# EAGLE design untitled (EAGLE 6.5.0)
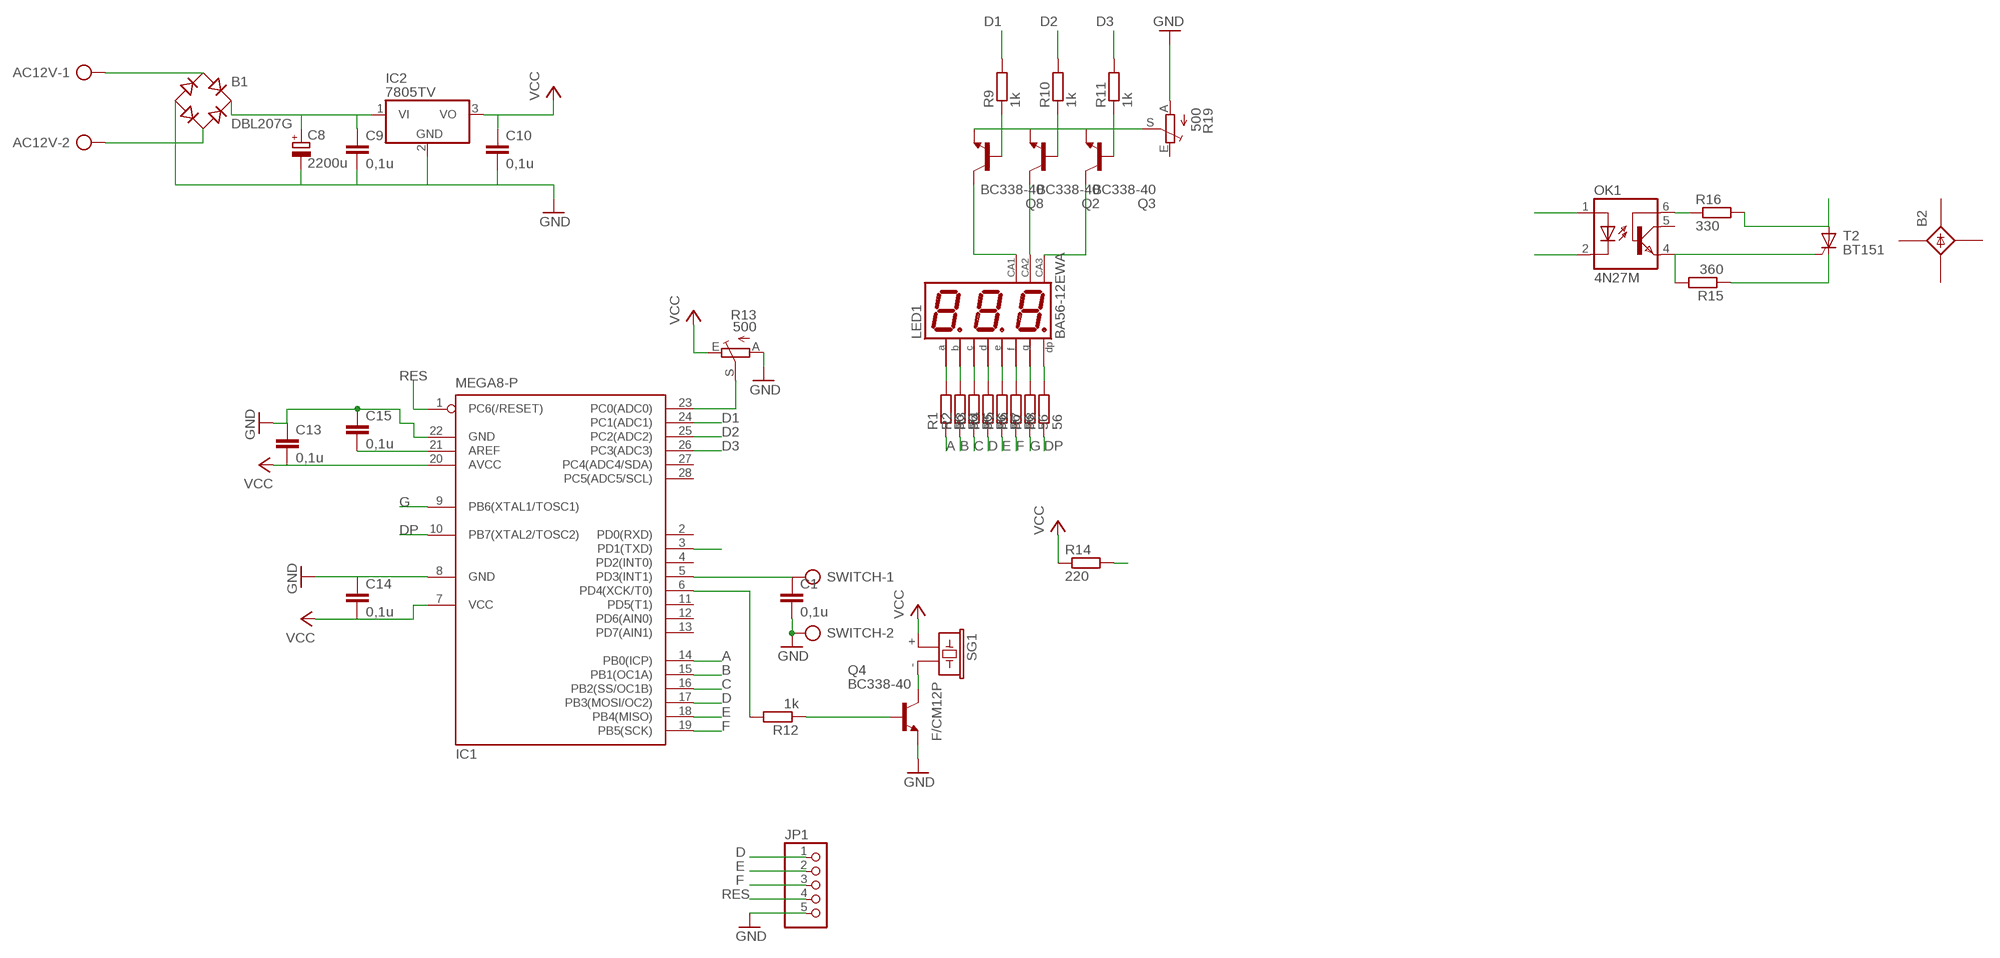
[diagram p0: schematic, sheet 1]

## Parts
AC12V  AK500/2  [AK500/2]
B1  DBL207G  [DB]
B2  B25A-  [B25A-]
C1  0,1u  C-EUC1206K  [C1206K]
C8  2200u  CPOL-EUE7.5-16  [E7,5-16]
C9  0,1u  C-EUC1206K  [C1206K]
C10  0,1u  C-EUC1206K  [C1206K]
C13  0,1u  C-EUC1206K  [C1206K]
C14  0,1u  C-EUC1206K  [C1206K]
C15  0,1u  C-EUC1206K  [C1206K]
IC1  MEGA8-P  [DIL28-3]
IC2  7805TV  [TO220V]
JP1  PINHD-1X5  [1X05]
LED1  BA56-12EWA  [BX56-12]
OK1  4N27M  [DIL06]
Q2  BC338-40  [TO92-EBC]
Q3  BC338-40  [TO92-EBC]
Q4  BC338-40  [TO92-EBC]
Q8  BC338-40  [TO92-EBC]
R1  56  R-EU_0204/7  [0204/7]
R2  56  R-EU_0204/7  [0204/7]
R3  56  R-EU_0204/7  [0204/7]
R4  56  R-EU_0204/7  [0204/7]
R5  56  R-EU_0204/7  [0204/7]
R6  56  R-EU_0204/7  [0204/7]
R7  56  R-EU_0204/7  [0204/7]
R8  56  R-EU_0204/7  [0204/7]
R9  1k  R-EU_0204/7  [0204/7]
R10  1k  R-EU_0204/7  [0204/7]
R11  1k  R-EU_0204/7  [0204/7]
R12  1k  R-EU_0204/7  [0204/7]
R13  500  TRIM_EU-CA6V  [CA6V]
R14  220  R-EU_0204/7  [0204/7]
R15  360  R-EU_0204/7  [0204/7]
R16  330  R-EU_0204/7  [0204/7]
R19  500  TRIM_EU-CA6V  [CA6V]
SG1  F/CM12P  [F/CM12P]
SWITCH  AK500/2  [AK500/2]
T2  BT151  [TO220CL]

## Nets
A: IC1.14(PB0(ICP)) R1.1
B: IC1.15(PB1(OC1A)) R2.1
C: IC1.16(PB2(SS/OC1B)) R3.1
C1: OK1.1(A) R14.2
C2: IC1.3(PD1(TXD)) OK1.2(C)
D: IC1.17(PB3(MOSI/OC2)) JP1.1 R4.1
D1: IC1.24(PC1(ADC1)) R9.2
D2: IC1.25(PC2(ADC2)) R10.2
D3: IC1.26(PC3(ADC3)) R11.2
DP: IC1.10(PB7(XTAL2/TOSC2)) R8.1
E: IC1.18(PB4(MISO)) JP1.2 R5.1
F: IC1.19(PB5(SCK)) JP1.3 R6.1
G: IC1.9(PB6(XTAL1/TOSC1)) R7.1
GND: B1.- C1.2 C8.- C9.2 C10.2 C13.1 C14.1 C15.1 IC1.8(GND) IC1.22(GND) IC2.2(GND) JP1.5 Q4.E R13.A R19.A SWITCH.2
N$1: LED1.11(A) R1.2
N$2: LED1.7(B) R2.2
N$3: LED1.4(C) R3.2
N$4: LED1.2(D) R4.2
N$5: LED1.1(E) R5.2
N$6: LED1.10(F) R6.2
N$7: LED1.5(G) R7.2
N$8: LED1.3(DP) R8.2
N$10: AC12V.1 B1.AC1
N$11: AC12V.2 B1.AC2
N$13: B1.+ C8.+ C9.1 IC2.1(VI)
N$14: C15.2 IC1.21(AREF)
N$15: LED1.12(CA) Q8.C
N$16: LED1.9(CA) Q2.C
N$17: LED1.8(CA) Q3.C
N$18: Q8.B R9.1
N$19: Q2.B R10.1
N$20: Q3.B R11.1
N$21: Q2.E Q3.E Q8.E R19.S
N$22: IC1.6(PD4(XCK/T0)) R12.2
N$23: Q4.B R12.1
N$24: Q4.C SG1.-
N$25: C1.1 IC1.5(PD3(INT1)) SWITCH.1
N$26: IC1.23(PC0(ADC0)) R13.S
N$31: OK1.6(BAS) R16.1
N$32: OK1.4(EMI) R15.2 T2.G
N$33: R15.1 T2.C
N$34: R16.2 T2.A
RES: IC1.1(PC6(/RESET)) JP1.4
VCC: C10.1 C13.2 C14.2 IC1.7(VCC) IC1.20(AVCC) IC2.3(VO) R13.E R14.1 SG1.+
Unconnected: B2.+ B2.+1(+) B2.- B2.-1(-) B2.AC1 B2.AC1-(AC1) B2.AC2 B2.AC2-(AC2) IC1.2(PD0(RXD)) IC1.4(PD2(INT0)) IC1.11(PD5(T1)) IC1.12(PD6(AIN0)) IC1.13(PD7(AIN1)) IC1.27(PC4(ADC4/SDA)) IC1.28(PC5(ADC5/SCL)) OK1.5(COL) R19.E

## Library data of the parts
AC12V SWITCH = con-ptr500:AK500/2: CONNECTOR; OC_FARNELL: unknown; OC_NEWARK: unknown
B1 = rectifier:DB?*G: Single Phase 1.0 AMP Glass Passivated Bridge Rectifier Taiwan Semiconductor Co.,Ltd. - TSC Source: http://www.taiwansemi.com/TSCbig5/ezcatfiles/cust/img/img/db101g.pdf http://www.ts.com.tw/db/pictures/modules/PDT/PDT060207001/DBLS201G.pdf
B2 = rectifier:B25A-: RECTIFIER 25-A bridge
C1 C9 C10 C13-C15 = rcl:C-EU: CAPACITOR, European symbol
C8 = rcl:CPOL-EU: POLARIZED CAPACITOR, European symbol
IC1 = atmel:MEGA8-P: MICROCONTROLLER 8 Kbytes FLASH, 1 kbytes SRAM, 512 bytes EEPROM, USART, 4-channel 10 bit ADC, 2-channel 8 bit ADC Pin compatible with Atmega48, ATMega88, ATMega168 Source: avr.lbr; OC_FARNELL: unknown; OC_NEWARK: unknown
IC2 = linear:78*: Positive VOLTAGE REGULATOR Source: http://cache.national.com/ds/LM/LM78L05.pdf http://www.fairchildsemi.com/ds/LM/LM7805.pdf
JP1 = pinhead:PINHD-1X5: PIN HEADER
LED1 = display-kingbright:B?56-12*WA: 14.22mm (0.56INCH) THREE DIGIT NUMERIC DISPLAY Source: http://www.kingbright.com .. BA56-11EWA(Ver1189474895.pdf; OC_FARNELL: unknown; OC_NEWARK: unknown
OK1 = optocoupler:4N*?M: General Purpose 6-Pin Phototransistor Optocouplers Source: http://www.fairchildsemi.com/ds/4N/4N35-M.pdf; MF: FAIRCHILD SEMICONDUCTOR; MPN: 4N27M; OC_FARNELL: unknown; OC_NEWARK: 72K9939
Q2-Q4 Q8 = transistor-npn:BC338*: NPN Transistor
R1-R12 R14-R16 = rcl:R-EU_: RESISTOR, European symbol
R13 R19 = pot:TRIM_EU-: POTENTIOMETER
SG1 = buzzer:F/CM12P: BUZZER Source: Buerklin; OC_FARNELL: unknown; OC_NEWARK: unknown
T2 = triac:BT151: THYRISTOR

## Board
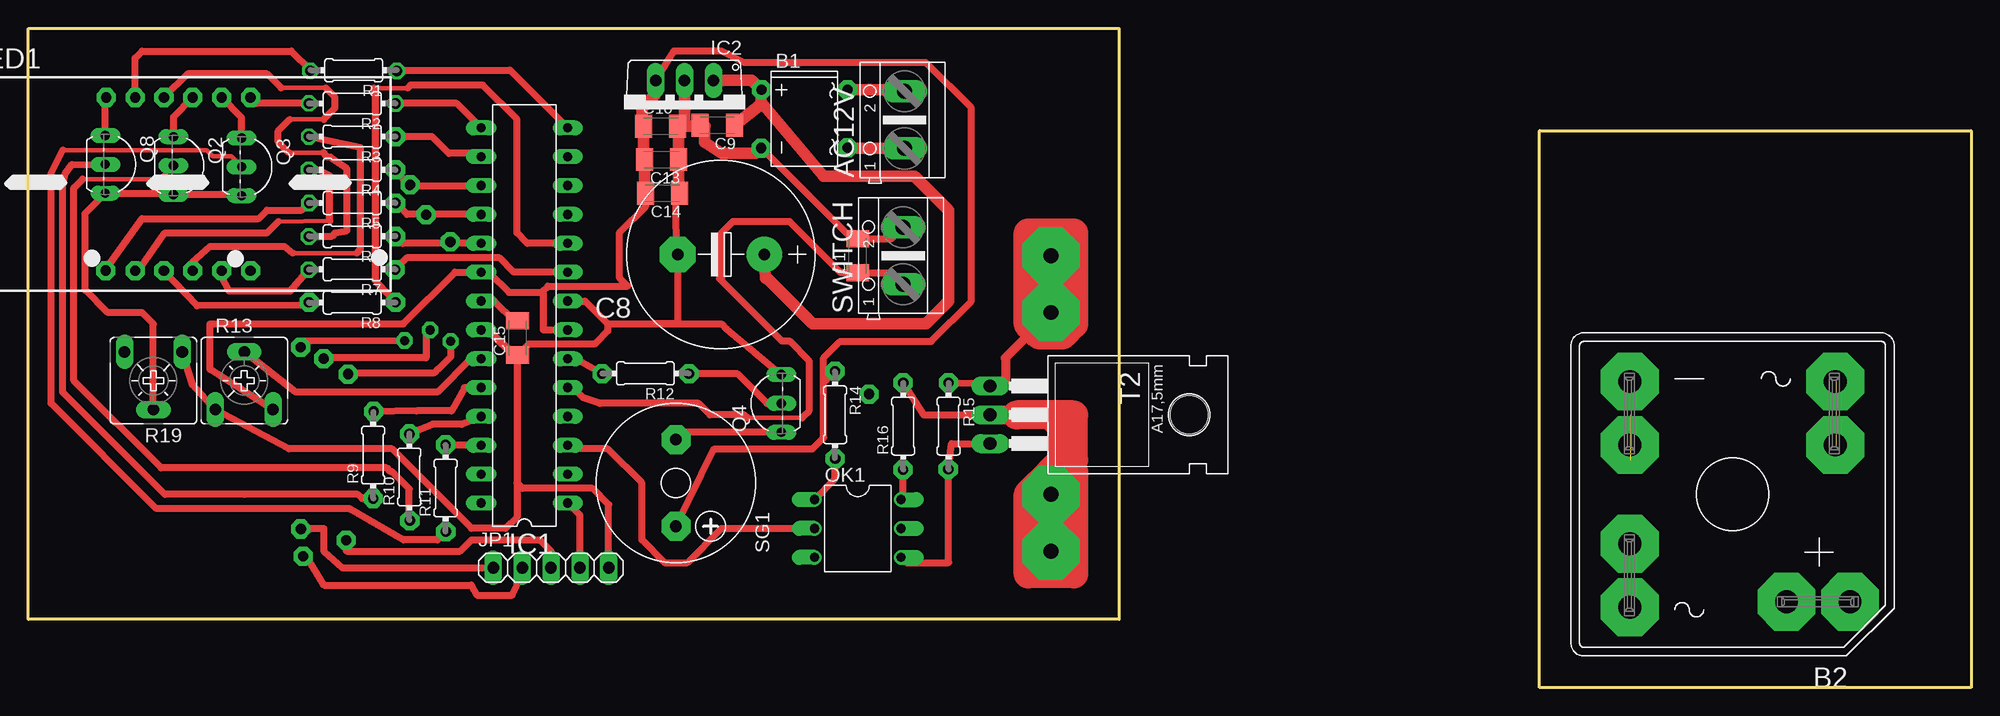
[diagram p1: board, top side]
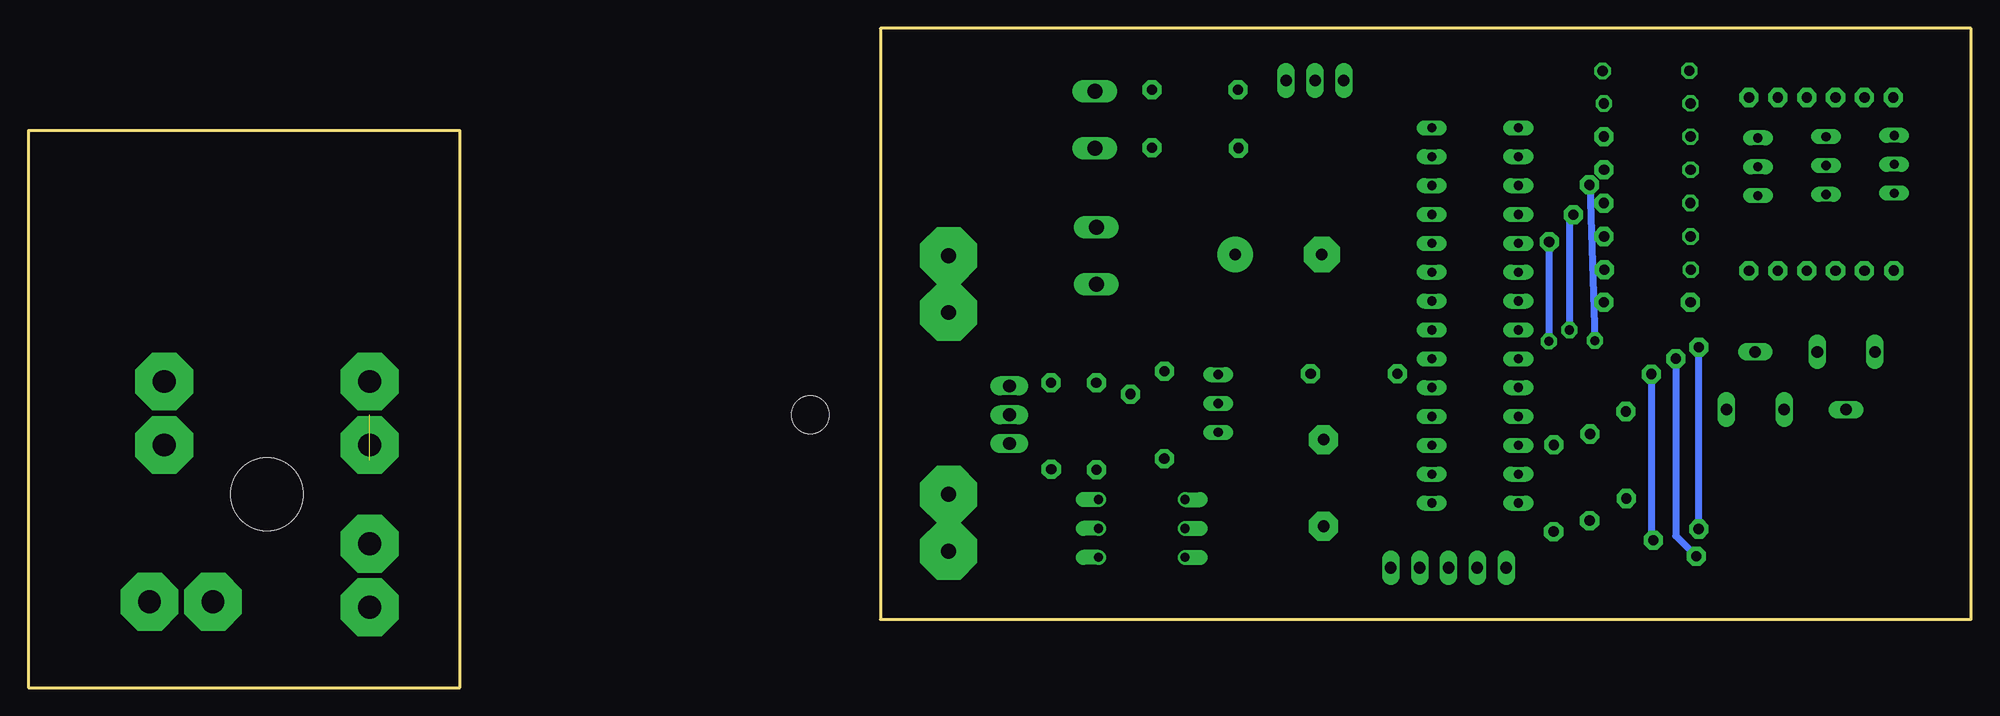
[diagram p2: board, bottom side, seen from below]

Size 171 x 58 mm. Coordinates in mm from the lower left corner, seen from the top.
Outline: 171,49 171,0 133,0 133,49 171,49
Outline: 96,58 96,6 0,6 0,58 96,58
Copper layers (1*16): Top 0.035mm / dielectric 1.5mm / Bottom 0.035mm
Design rules "default": minimum track width 10mil, minimum drill 24mil, track to track 8mil, track to pad 8mil, pad to pad 8mil, via to via 8mil, smd to smd 8mil, copper to edge 40mil, drill to drill 8mil, minimum pad ring 10mil, minimum via ring 8mil, stop-mask expansion 4mil, vias tented up to drill 0mil, thermal gap 10mil

### Footprints (pad centres in the part's own frame; a part is rotated, then mirrored left to right if it is on the bottom)
AK500/2 = drill 1.321 long: 1 -2.515,0; 2 2.515,0
DB = drill 0.813: + -2.54,-3.81 | drill 0.813 octagon: - 2.54,-3.81; AC1 2.54,3.81; AC2 -2.54,3.81
B25A- = drill 2.007 pad 5.08 octagon: + -10.338,9.449; +1 -4.75,9.449; - 9.042,-4.343; -1 9.042,-9.931; AC1 9.042,4.343; AC1- 9.042,9.931; AC2 -9.042,-4.343; AC2- -9.042,-9.931 | hole 6.401: 0,0
C1206K = smd 1.5 x 2: 1 -1.5,0; 2 1.5,0
E7,5-16 = drill 1.016 pad 3.15: + -3.81,0 | drill 1.016 pad 3.15 octagon: - 3.81,0
DIL28-3 = drill 0.813 long: 1 -16.51,-3.81; 2 -13.97,-3.81; 3 -11.43,-3.81; 4 -8.89,-3.81; 5 -6.35,-3.81; 6 -3.81,-3.81; 7 -1.27,-3.81; 8 1.27,-3.81; 9 3.81,-3.81; 10 6.35,-3.81; 11 8.89,-3.81; 12 11.43,-3.81; 13 13.97,-3.81; 14 16.51,-3.81; 15 16.51,3.81; 16 13.97,3.81; 17 11.43,3.81; 18 8.89,3.81; 19 6.35,3.81; 20 3.81,3.81; 21 1.27,3.81; 22 -1.27,3.81; 23 -3.81,3.81; 24 -6.35,3.81; 25 -8.89,3.81; 26 -11.43,3.81; 27 -13.97,3.81; 28 -16.51,3.81
TO220V = drill 1.016 long: 1 -2.54,-2.54; 2 0,-2.54; 3 2.54,-2.54
1X05 = drill 1.016 long: 1 -5.08,0; 2 -2.54,0; 3 0,0; 4 2.54,0; 5 5.08,0
BX56-12 = drill 0.8 pad 1.422: 1 -6.35,-7.62; 2 -3.81,-7.62; 3 -1.27,-7.62; 4 1.27,-7.62; 5 3.81,-7.62; 6 6.35,-7.62; 7 6.35,7.62; 8 3.81,7.62; 9 1.27,7.62; 10 -1.27,7.62; 11 -3.81,7.62; 12 -6.35,7.62
DIL06 = drill 0.813 offset: 1 -2.54,-3.81; 2 0,-3.81; 3 2.54,-3.81; 4 2.54,3.81; 5 0,3.81; 6 -2.54,3.81
TO92-EBC = drill 0.813 long: B 0,-1.27; C -2.54,-1.27; E 2.54,-1.27
0204/7 = drill 0.813 octagon: 1 -3.81,0; 2 3.81,0
CA6V = drill 1.016 long: A -2.54,-2.54; E 2.54,-2.54; S 0,2.54
F/CM12P = drill 1.016 pad 2.54 octagon: + 3.81,0; - -3.81,0
TO220CL = drill 1.118 long: A 0,-6.35; C -2.54,-6.35; G 2.54,-6.35 | hole 3.302: 0,11.176

### Placement (x,y rotation side)
AC12V  77.12,49.95 90 top
B1  68.31,50.05 270 top
B2  150,17 180 top
C1  73,38 90 top
C8  60.96,38.11 180 top
C9  60.64,49.47 180 top
C10  55.66,49.39 0 top
C13  55.74,46.46 180 top
C14  55.81,43.5 180 top
C15  43.07,30.76 90 top
IC1  43.66,32.74 90 top
IC2  57.75,50.88 180 top
JP1  46,10.54 0 top
LED1  13.2,44.3 0 top
OK1  73,14 270 top
Q2  14.04,45.93 270 top
Q3  20.04,45.82 270 top
Q4  65,25 90 top
Q8  8.04,46.04 270 top
R1  28.64,54.32 180 top
R2  28.5,51.4 180 top
R3  28.5,48.48 180 top
R4  28.5,45.56 180 top
R5  28.5,42.64 180 top
R6  28.5,39.72 180 top
R7  28.5,36.8 180 top
R8  28.5,33.88 180 top
R9  30.35,20.45 90 top
R10  33.53,18.53 90 top
R11  36.72,17.55 90 top
R12  54.31,27.64 180 top
R13  19,27 0 top
R14  71,24 270 top
R15  81,23 270 top
R16  77,23 90 top
R19  11,27 180 top
SG1  57,18 270 top
SWITCH  77,38 90 top
T2  91,24 270 top

### Tracks (layer width: path | path; a pad name or v marks a point on that pad's centre or on a via)
A
  Top 0.61: R1.1 42.4,54.32 IC1.14
B
  Top 0.61: IC1.15 37.7,51.4 R2.1
C
  Top 0.61: IC1.16 39.56,47 37,47 35.52,48.48 R3.1
C1
  Top 0.61: OK1.1 71,18.35 R14.2
C2
  Top 0.61: IC1.3 47.78,21 51,21 54,18 54,13 56,11 58,11 61,14 OK1.2
D  (via drill 0.8 pad 1.42)
  Top 0.61: v33.12,30.53 24,30.47 v24,30 | v24,14 26,14 26,12 27.6,10.54 JP1.1 | R4.1 32.31,45.41 v33.55,44.17 IC1.17
  Bottom 0.61: v33.55,44.17 v33.12,30.53 | v24,30 v24,14
D1
  Top 0.61: IC1.24 38.39,26.39 37.25,24.35 34.16,24.35 R9.2
D2
  Top 0.61: IC1.25 38.14,23.16 37.07,23.18 35.58,23.18 R10.2
D3
  Top 0.61: IC1.26 36.61,21.31 R11.2
DP
  Top 0.406: 33.39,52.75 30.4,52.75
  Top 0.61: IC1.10 43.91,39.09 43,40 43,50 40,53 33.64,53 33.39,52.75 | 30.4,52.75 30.5,52.18 30.5,35.86 R8.1
E  (via drill 0.8 pad 1.42)
  Top 0.61: IC1.18 v35,41.63 | v35,41.63 33.32,41.63 R5.1 | 35.5,41.66 35,41.66 v35,41.63 | v35.35,31.46 35,31.46 35,29 v26,29 | v24.19,11.54 24.46,11.54 26,9 39,9 39,8.93 39.46,8.13 42.59,8.13 43,9 43,10.54 JP1.2
  Bottom 0.61: v35,41.63 35.35,41.63 v35.35,31.46 | v26,29 26,13.35 v24.19,11.54
F  (via drill 0.8 pad 1.42)
  Top 0.61: IC1.19 37,39.09 | 37,39.09 32.94,39.09 R6.1 | v37.14,39.16 37,39.16 37,39.09 | v37.18,30.46 37.18,29.12 36.09,28.03 36.07,28.03 35.7,27.66 v28.15,27.66 v28.14,27.67 | v28,13 28,12 38,12 39,13 45,13 46,12 JP1.3
  Bottom 0.61: v37.14,39.16 37.18,39.16 v37.18,30.46 | 28.08,13.08 v28,13 28.14,13.14 v28.14,27.67
G
  Top 0.61: IC1.9 42.71,36.55 41.46,37.8 33.31,37.8 R7.1
GND
  Top 0.61: 49,34 48.99,34.01 IC1.8 49,34 | 51,32 51,31.38 49.95,30.33 49.95,30.31 49.85,30.21 44.02,30.21 C15.1 42.74,29.26 40.53,31.47 IC1.22 40.4,31.48 43,28.88 43,18 | 49,34 51,32 | 51,32 55,32 | 55,32 61,32 61.46,31.54 Q4.E | 43,18 43,15 42,14 39,14 32,21 22.92,21 R13.A 14.46,26.62 R19.A | SWITCH.2 75.98,39.5 C1.2 72.51,39.5 B1.- | C14.1 57,43.19 57,41 57.15,37.15 C8.- 57.13,31.99 55,32 | JP1.5 51.08,16.1 49.66,17.52 43.48,17.52 43,18
  Top 1.016: IC2.2 57.75,49.98 C10.2 | C10.2 59.58,49.39 C9.2 59.5,49.01 59.5,48 61,47 64,47 B1.- | C10.2 57.24,49.31 C13.1 57.24,43.57 C14.1
N$1
  Top 0.61: LED1.11 9.39,55.39 10,56 23.14,56 R1.2
N$2
  Top 0.61: R2.2 20.07,51.4 LED1.7
N$3
  Top 0.406: 23.28,38.23 28.92,38.23
  Top 0.61: LED1.4 14.47,37.47 16,38.82 22.51,38.82 23.28,38.23 | 28.92,38.23 29.23,38.63 29.23,47.51 R3.2
N$4
  Top 0.406: 22,41 26.53,41.06
  Top 0.61: LED1.2 9.68,36.68 12,40 21,40 22,41 | 26.53,41.06 26.51,45.04 25.44,45.56 R4.2
N$5
  Top 0.61: LED1.1 6.85,36.85 10,41.27 20.27,41.27 21,42 24.05,42 R5.2
N$6
  Top 0.406: 25.95,47.07 22.93,47.07 | 23,50 26,50 | 26.18,52.76 22.24,52.76
  Top 0.61: R6.2 26.72,39.72 27,40 27.02,40 28.05,40.21 28.05,45.63 26.57,46.67 26.3,46.67 26.1,46.87 26.1,46.92 25.95,47.07 | 22.93,47.07 22,48 22,49 23,50 | 26,50 27,51 27,51.94 26.18,52.76 | 22.24,52.76 21,54 14.01,54 LED1.10
N$7
  Top 0.61: LED1.5 17.01,36.06 17.63,34.91 23.05,34.91 R7.2
N$8
  Top 0.61: R8.2 24.44,33.63 14.84,33.59 LED1.3
N$10
  Top 1.016: AC12V.1 72.19,47.44 B1.AC1
N$11
  Top 1.016: B1.AC2 77,52.59 AC12V.2
N$13
  Top 1.016: IC2.1 63.67,53.42 B1.+ 64.5,51.31 C9.1 64.59,51.41 70,45 78,45 81,42 81,34 79,32 69,32 65,36 64.88,36 C8.+
N$14
  Top 0.61: IC1.21 41,34 42.74,32.26 C15.2
N$15
  Top 0.61: Q8.C 6.77,51.84 LED1.12
N$16
  Top 0.61: Q2.C 12.77,50.22 LED1.9
N$17
  Top 0.61: Q3.C 18.77,50.16 LED1.8
N$18
  Top 0.61: R9.1 29.36,16.64 29,17 25,17.01 19,17 12,17 3,26 3,44.27 3.22,45.21 3.82,46.02 Q8.B
N$19
  Top 0.406: 4.77,44.73 11.57,44.73 Q2.B
  Top 0.61: R10.1 33.53,17.47 32,19 31.86,19 31.54,19.32 11.68,19.32 4,27 4,44 4.04,44 4.77,44.73
N$20
  Top 0.406: 3.04,47.29 15.69,47.29 16.24,46.74 17.85,46.74 Q3.B
  Top 0.61: R11.1 36,13 33,13 28.26,15.74 11.26,15.74 2,25 2,45.25 3.04,47.29
N$21
  Top 0.61: R19.S 11,32 10,33 7,33 5,35 5,41.73 Q8.E 12.66,43.5 Q2.E 18.66,43.39 Q3.E
N$22
  Top 0.61: IC1.6 48.21,28.93 R12.2
N$23
  Top 0.61: R12.1 62.36,27.64 65,25 Q4.B
N$24
  Top 0.61: Q4.C 57.65,22.46 SG1.-
N$25
  Top 0.406: 68.11,23.72 63.28,23.72
  Top 0.61: IC1.5 47.94,26.39 48.81,25.52 50.29,25 59,25 60,24 63,24 63.28,23.72 | SWITCH.1 75.98,36.5 C1.1 71.5,36.5 67,41 62,41 61,40 61,36 60.81,36 66.31,30.5 66.98,30.5 68.71,28.77 68.71,24.32 68.11,23.72
N$26
  Top 0.61: IC1.23 38.93,28.93 36,26 23.54,26 R13.S
N$28  (via drill 0.9 pad 1.42, 0.9 pad 1.68)
  other vias: 77,26.82 81,26.82 71,27.82 74,25.82 71.02,20.14 76.99,19.17 80.97,19.2 64.49,47.47 72.1,47.49 72.11,52.59 64.53,52.59 58.14,27.62 50.49,27.62 27.98,12.95 23.98,13.95 24.18,11.55 30.34,16.63 33.58,14.69 36.75,13.72 36.73,21.35 33.54,22.31 30.38,24.29 28.14,27.58 26,28.94 23.97,29.94 6.81,36.69 9.39,36.68 11.93,36.68 14.47,36.68 17.01,36.68 17.01,36.68 17.01,36.68 19.55,36.68 19.55,51.92 17.01,51.92 14.47,51.92 11.93,51.92 9.39,51.92 6.85,51.92 24.8,54.28 24.7,51.4 32.44,54.25 32.32,51.39 32.32,48.48 24.7,48.48 24.69,45.56 32.31,45.56 32.33,42.63 24.71,42.63 24.69,39.69 32.31,39.69 32.29,36.77 24.67,36.77 24.7,33.91 32.32,33.91 35.01,41.59 37.14,39.23 33.61,44.24
N$31
  Top 0.61: OK1.6 77,16.73 R16.1
N$32
  Top 0.61: T2.G 81.27,21.46 R15.2 81,11 77.27,11 OK1.4
N$33  (via drill 1.3 pad 5)
  Top 0.61: R15.1 84.22,26.78 85.27,26.54 T2.C
  Top 0.813: v90,33 86,29 86,27 84.22,26.78
  Top 2.54: v90,38 v90,33 89,33 88,34 | 88,34 88,40 92,40 92,32 91,31 89,31 88,32 88,34
N$34  (via drill 1.3 pad 5)
  Top 0.61: R16.2 78.81,24 T2.A
  Top 1.676: T2.A 87,24
  Top 2.54: 90,24 91,23 91,20 | 90,19 v90,17 v90,12 | 91,20 92,19 92,10 88,10 88,17 90,19 | 90,19 91,20 | 91,20 92,20 92,24 90,24 | 90,24 87,24
N$38  (1 unrouted)
RES
  Top 0.61: JP1.4 48.54,15.16 IC1.1
VCC
  Top 0.61: IC1.20 40.53,36.55 | 40.53,36.55 42.31,34.77 45.18,34.77 | 45.18,34.77 45.23,34.77 45.31,34.7 45.31,31.47 IC1.7 | IC1.20 39.88,36.58 40.5,36.58 40.53,36.55 | 45.18,34.77 45.73,35.32 52.76,35.32 52,36.08 52,40 54.31,42.31 C14.2 | R13.E 16,28 16,32 33,32 37.55,36.55 IC1.20 | SG1.+ 60.36,20.99 69,21 70,22 70,26.81 | 70,26.81 R14.1 | 70,26.81 70,29 71.46,30.46 79.46,30.46 83,34 83,51 79,55 63,55 61,56 56.79,56 IC2.3
  Top 1.016: IC2.3 55.21,52.21 54,51 54,49.55 C10.1 54.16,46.54 C13.2 54.24,43.57 C14.2